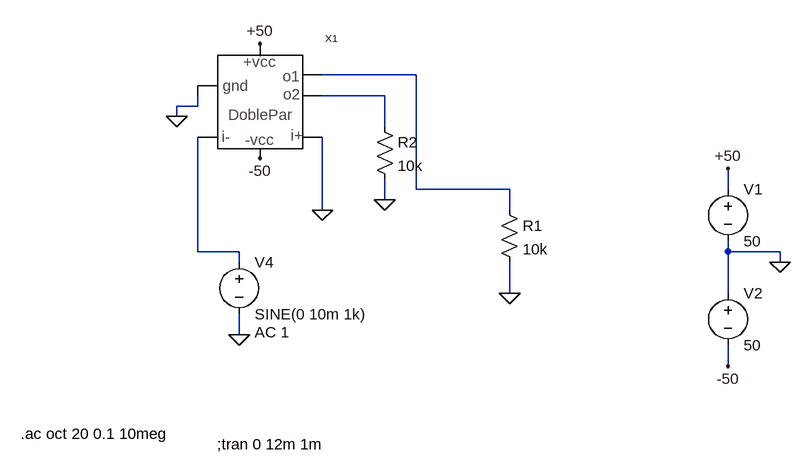
[diagram p0: schematic doble-par_allB.asc]
doble-par_allB.asc, the LTspice schematic file:
Version 4
SHEET 1 940 680
WIRE 224 -80 80 -80
WIRE 176 -48 80 -48
WIRE -112 -32 -112 -48
WIRE -112 -32 -144 -32
WIRE -144 -16 -144 -32
WIRE 176 0 176 -48
WIRE 224 96 224 -80
WIRE 368 96 224 96
WIRE 704 96 704 64
WIRE 176 112 176 80
WIRE 80 128 80 16
WIRE 368 128 368 96
WIRE -112 192 -112 16
WIRE -48 192 -112 192
WIRE 704 192 704 176
WIRE 784 192 704 192
WIRE -48 208 -48 192
WIRE 784 208 784 192
WIRE 368 256 368 208
WIRE 704 256 704 192
WIRE -48 320 -48 288
WIRE 704 368 704 336
FLAG 784 208 0
FLAG 704 64 +50
FLAG 704 368 -50
FLAG -16 -128 +50
FLAG -48 320 0
FLAG -144 -16 0
FLAG 368 256 0
FLAG 176 112 0
FLAG 80 128 0
FLAG -16 48 -50
SYMBOL rui\\shortcuts\\voltage 704 80 R0
WINDOW 123 0 0 Left 2
WINDOW 39 0 0 Left 2
SYMATTR InstName V1
SYMATTR Value 50
SYMBOL rui\\shortcuts\\voltage 704 240 R0
WINDOW 123 0 0 Left 2
WINDOW 39 0 0 Left 2
SYMATTR InstName V2
SYMATTR Value 50
SYMBOL rui\\shortcuts\\voltage -48 192 R0
WINDOW 123 24 124 Left 2
WINDOW 39 0 0 Left 2
SYMATTR InstName V4
SYMATTR Value SINE(0 10m 1k)
SYMATTR Value2 AC 1
SYMBOL res 352 112 R0
SYMATTR InstName R1
SYMATTR Value 10k
SYMBOL ss-doble-par -16 -48 R0
SYMATTR InstName X1
SYMBOL res 160 -16 R0
SYMATTR InstName R2
SYMATTR Value 10k
TEXT -82 488 Left 2 !;tran 0 12m 1m
TEXT -384 472 Left 2 !.ac oct 20 0.1 10meg

The netlist it stands for:
* doble-par_allB.asc
V1 +50 0 50
V2 0 -50 50
V4 N003 0 SINE(0 10m 1k) AC 1
R1 N001 0 10k
XX1 N003 0 N001 +50 -50 0 N002 ss-doble-par  ; pins i- i+ o1 vcc+ vcc- grnd o2
R2 N002 0 10k
;tran 0 12m 1m
.ac oct 20 0.1 10meg
.backanno
.end